# Altium project VCAN.PrjPcb
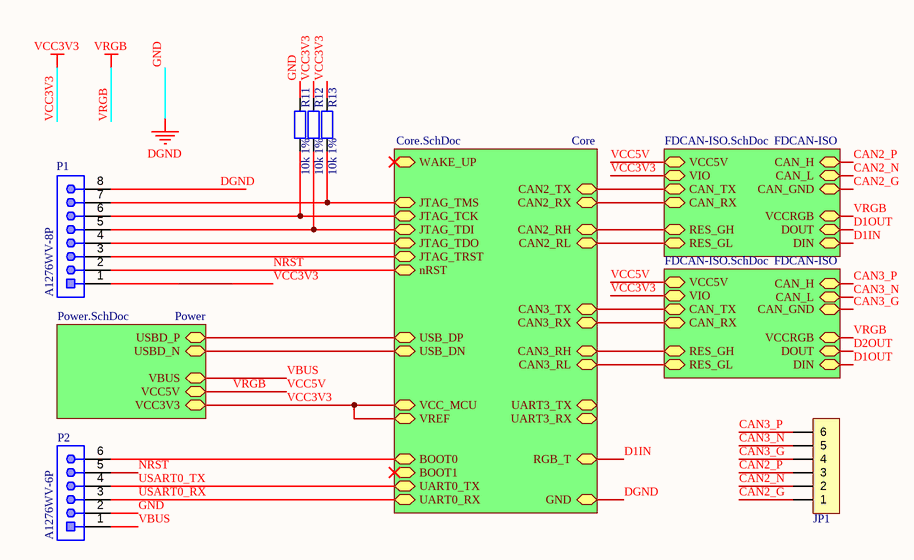
[diagram p0: VCAN.SchDoc]
4 sheets, 103 parts. Net scope: hierarchical (ports join the sheet entries above them; power ports are global).
Board file: VCAN.PcbDoc
Sheets:
  VCAN.SchDoc
    Core = Core.SchDoc
    Power = Power.SchDoc
    FDCAN-ISO = FDCAN-ISO.SchDoc
    FDCAN-ISO = FDCAN-ISO.SchDoc

## Sheet VCAN.SchDoc
size 209 x 148 mm; Author: vseasky; Address1: https://docs.liuwei.vin; Revision: V0.2; SheetNumber: 1; SheetTotal: 4

### Parts
JP1  HDR-1X6  [HT3.96-WI-6P-SMD]  (value not drawn)
P1  A1276WV-8P  [CJT-A1276WV-8P_V]
P2  A1276WV-6P  [CJT-A1276WV-6P_V]
R11  10k 1%  [R 0603_L]
R12  10k 1%  [R 0603_L]
R13  10k 1%  [R 0603_L]

### Sub-sheets
Core = Core.SchDoc: nRST (bidir), WAKE_UP (bidir), JTAG_TDO (bidir), JTAG_TDI (bidir), JTAG_TCK (bidir), JTAG_TMS (bidir), JTAG_TRST (bidir), GND (bidir), USB_DP (bidir), USB_DN (bidir), UART0_TX (bidir), UART0_RX (bidir), VCC_MCU (bidir), VREF (bidir), BOOT0 (bidir), BOOT1 (bidir), UART3_RX (bidir), UART3_TX (bidir), CAN3_RX (bidir), CAN3_TX (bidir), RGB_T (bidir), CAN2_TX (bidir), CAN2_RX (bidir), CAN3_RH (bidir), CAN2_RH (bidir), CAN2_RL (bidir), CAN3_RL (bidir)
FDCAN-ISO = FDCAN-ISO.SchDoc: CAN_H (bidir), CAN_L (bidir), CAN_RX (bidir), CAN_TX (bidir), CAN_GND (bidir), VCC5V (bidir), VIO (bidir), RES_GH (bidir), RES_GL (bidir), VCCRGB (bidir), DOUT (bidir), DIN (bidir)
FDCAN-ISO = FDCAN-ISO.SchDoc: CAN_H (bidir), CAN_L (bidir), CAN_RX (bidir), CAN_TX (bidir), CAN_GND (bidir), VCC5V (bidir), VIO (bidir), RES_GH (bidir), RES_GL (bidir), VCCRGB (bidir), DOUT (bidir), DIN (bidir)
Power = Power.SchDoc: VCC3V3 (bidir), VCC5V (bidir), USBD_P (bidir), USBD_N (bidir), VBUS (bidir)

### Nets
DGND: P1.8 P2.2 R11.1 ; sheet Core/GND  [also labelled GND]
VCC3V3: P1.1 R12.1 R13.1 ; sheet Core/VCC_MCU, sheet Core/VREF, sheet Power/VCC3V3, sheet FDCAN-ISO/VIO, sheet FDCAN-ISO/VIO
VCC5V: sheet Power/VCC5V, sheet FDCAN-ISO/VCC5V, sheet FDCAN-ISO/VCCRGB, sheet FDCAN-ISO/VCC5V, sheet FDCAN-ISO/VCCRGB  [also labelled VRGB]
BOOT0: P2.6 ; sheet Core/BOOT0
CAN2_G: JP1.1 ; sheet FDCAN-ISO/CAN_GND
CAN2_N: JP1.2 ; sheet FDCAN-ISO/CAN_L
CAN2_P: JP1.3 ; sheet FDCAN-ISO/CAN_H
CAN2_RX: sheet Core/CAN2_RX, sheet FDCAN-ISO/CAN_RX
CAN2_TX: sheet Core/CAN2_TX, sheet FDCAN-ISO/CAN_TX
CAN3_G: JP1.4 ; sheet FDCAN-ISO/CAN_GND
CAN3_N: JP1.5 ; sheet FDCAN-ISO/CAN_L
CAN3_P: JP1.6 ; sheet FDCAN-ISO/CAN_H
CAN3_RX: sheet Core/CAN3_RX, sheet FDCAN-ISO/CAN_RX
CAN3_TX: sheet Core/CAN3_TX, sheet FDCAN-ISO/CAN_TX
D1IN: sheet Core/RGB_T, sheet FDCAN-ISO/DIN
D1OUT: sheet FDCAN-ISO/DOUT, sheet FDCAN-ISO/DIN
JTAG_TCK: P1.6 R11.2 ; sheet Core/JTAG_TCK
JTAG_TDI: P1.5 R12.2 ; sheet Core/JTAG_TDI
JTAG_TDO: P1.4 ; sheet Core/JTAG_TDO
JTAG_TMS: P1.7 R13.2 ; sheet Core/JTAG_TMS
JTAG_TRST: P1.3 ; sheet Core/JTAG_TRST
NRST: P1.2 P2.5 ; sheet Core/nRST
RES_GH: sheet Core/CAN2_RH, sheet FDCAN-ISO/RES_GH
RES_GH: sheet Core/CAN3_RH, sheet FDCAN-ISO/RES_GH  [a separate net that carries the same name]
RES_GL: sheet Core/CAN2_RL, sheet FDCAN-ISO/RES_GL
RES_GL: sheet Core/CAN3_RL, sheet FDCAN-ISO/RES_GL  [a separate net that carries the same name]
USART0_RX: P2.3 ; sheet Core/UART0_RX  [project net UART0_RX]
USART0_TX: P2.4 ; sheet Core/UART0_TX  [project net UART0_TX]
USB_D_N: sheet Core/USB_DN, sheet Power/USBD_N
USB_D_P: sheet Core/USB_DP, sheet Power/USBD_P
VBUS: P2.1 ; sheet Power/VBUS  [project net USB_VBUS]

### Library data of the parts
JP1 = Header 6: 6P接插件
P1 = A1276WV-8P: Pin Header, 1.27mm Pitch 180° Single Row, 1 x 8 Position, Height 3.7 mm, -40 to 105 degC, RoHS; Manufacturer: Changjiang Connectors; Contact Resistance: 20mΩ; Current (Max): 1A; Insulation Resistance: 1000MΩ; No. of Rows: 1; No. of Positions: 8; Operating Voltage (V AC/DC): 30V; PIN Material: Brass; PIN Plating: Gold over Nickel; Product Series: A1276 Series; ComponentLink1Description: Manufacturer; ComponentLink1URL: http://www.cjt.com/; ComponentLink2Description: Datasheet; ComponentLink2URL: http://www.cjt.com/UP/A1276WV-XP_dwg.pdf; Part Number: A1276WV-8P; Pitch: 1.27mm; Datasheet Version: REV. A0, 06/2014; Assembly Type: Wafer; Category: Wire to Board; Color: Black; Housing Material: PBT,UL94V-0; Operating Temperature Range: -40℃~105℃; Publisher: Bolgen Studio
P2 = A1276WV-6P: Pin Header, 1.27mm Pitch 180° Single Row, 1 x 6 Position, Height 3.7 mm, -40 to 105 degC, RoHS; Manufacturer: Changjiang Connectors; Contact Resistance: 20mΩ; Current (Max): 1A; Insulation Resistance: 1000MΩ; No. of Rows: 1; No. of Positions: 6; Operating Voltage (V AC/DC): 30V; PIN Material: Brass; PIN Plating: Gold over Nickel; Product Series: A1276 Series; ComponentLink1Description: Manufacturer; ComponentLink1URL: http://www.cjt.com/; ComponentLink2Description: Datasheet; ComponentLink2URL: http://www.cjt.com/UP/A1276WV-XP_dwg.pdf; Part Number: A1276WV-6P; Pitch: 1.27mm; Datasheet Version: REV. A0, 06/2014; Assembly Type: Wafer; Category: Wire to Board; Color: Black; Housing Material: PBT,UL94V-0; Operating Temperature Range: -40℃~105℃; Publisher: Bolgen Studio
R11-R13 = R: 贴片电阻

## Sheet Core.SchDoc
size A4; Author: vseasky; Address1: https://docs.liuwei.vin; Revision: V0.2; SheetNumber: 3; SheetTotal: 4
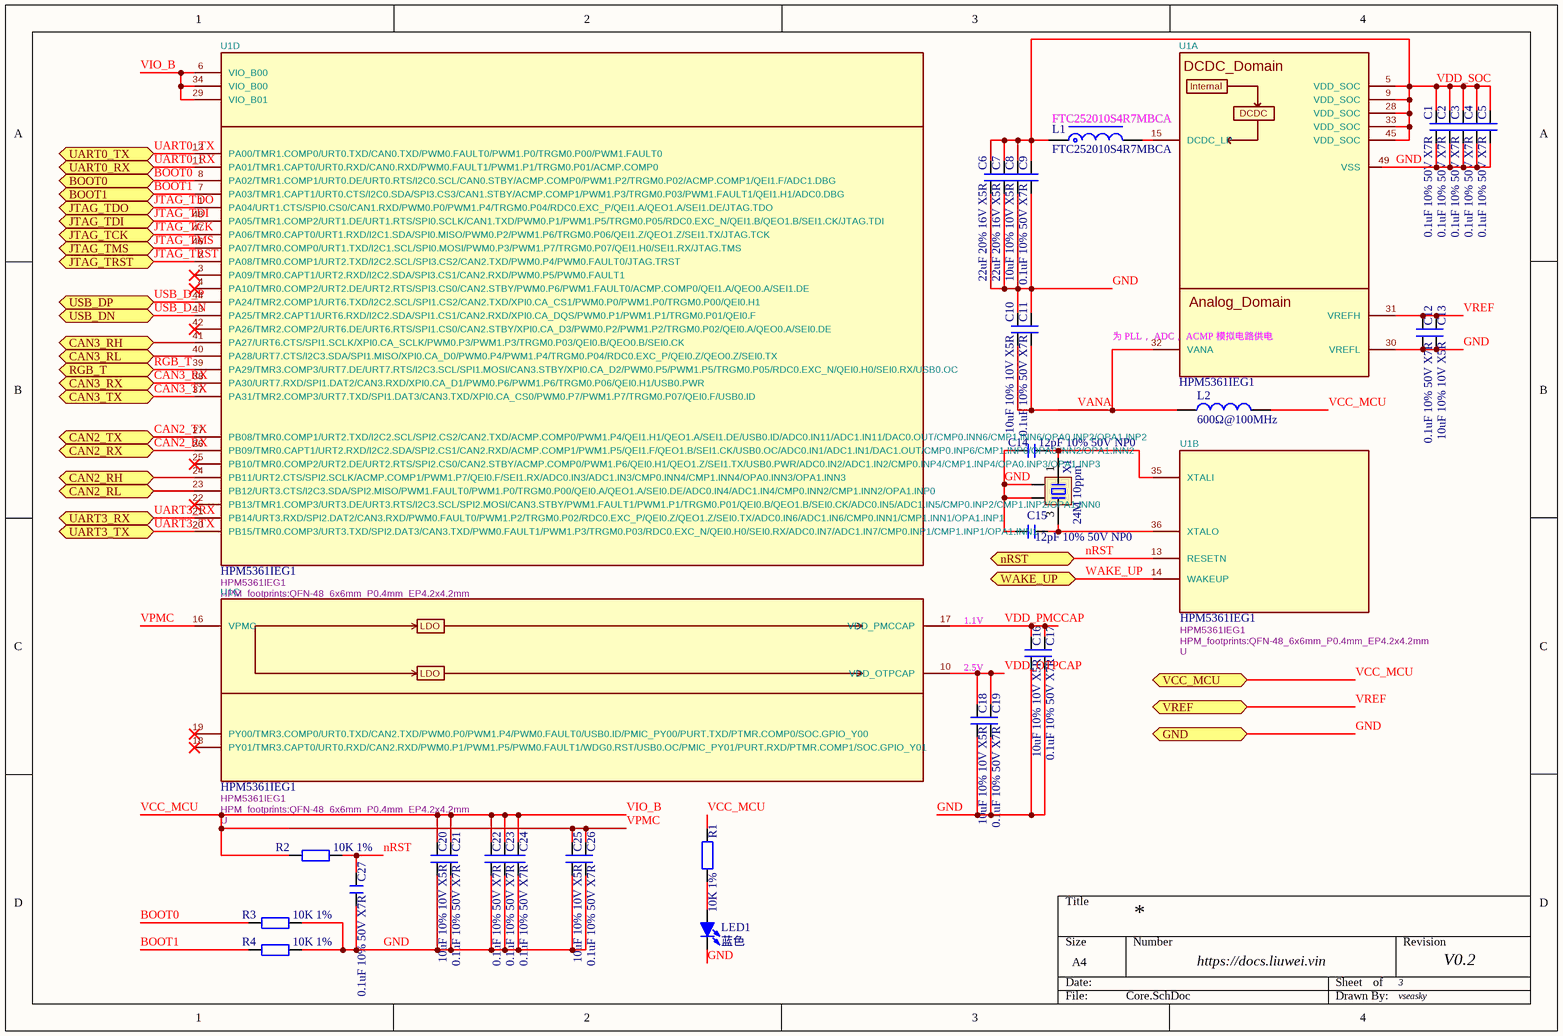
[diagram p1: Core.SchDoc]

### Parts
C1  0.1uF 10% 50V X7R  [C 0603_L]
C2  0.1uF 10% 50V X7R  [C 0603_L]
C3  0.1uF 10% 50V X7R  [C 0603_L]
C4  0.1uF 10% 50V X7R  [C 0603_L]
C5  0.1uF 10% 50V X7R  [C 0603_L]
C6  22uF 20% 16V X5R  [C 0603_L]
C7  22uF 20% 16V X5R  [C 0603_L]
C8  10uF 10% 10V X5R  [C 0603_L]
C9  0.1uF 10% 50V X7R  [C 0603_L]
C10  10uF 10% 10V X5R  [C 0603_L]
C11  0.1uF 10% 50V X7R  [C 0603_L]
C12  0.1uF 10% 50V X7R  [C 0603_L]
C13  10uF 10% 10V X5R  [C 0603_L]
C14  12pF 10% 50V NP0  [C 0603_L]
C15  12pF 10% 50V NP0  [C 0603_L]
C16  10uF 10% 10V X5R  [C 0603_L]
C17  0.1uF 10% 50V X7R  [C 0603_L]
C18  10uF 10% 10V X5R  [C 0603_L]
C19  0.1uF 10% 50V X7R  [C 0603_L]
C20  10uF 10% 10V X5R  [C 0603_L]
C21  0.1uF 10% 50V X7R  [C 0603_L]
C22  0.1uF 10% 50V X7R  [C 0603_L]
C23  0.1uF 10% 50V X7R  [C 0603_L]
C24  0.1uF 10% 50V X7R  [C 0603_L]
C25  10uF 10% 10V X5R  [C 0603_L]
C26  0.1uF 10% 50V X7R  [C 0603_L]
C27  0.1uF 10% 50V X7R  [C 0603_L]
L1  FTC252010S4R7MBCA  [NR2520]
L2  600Ω@100MHz  [L 0603_L]
LED1  蓝色  [LED 0603R]
R1  10K 1%  [R 0603_L]
R2  10K 1%  [R 0603_L]
R3  10K 1%  [R 0603_L]
R4  10K 1%  [R 0603_L]
U1  HPM5361IEG1  [QFN-48_6x6mm_P0.4mm_EP4.2x4.2mm]  (parts A,B,C,D of 4)
X1  24M 10ppm  [OSC 3225-4P]

### Ports
BOOT0 (bidir, see VCAN[5C]), BOOT1 (bidir, see VCAN[5C]), CAN2_RH (bidir, see VCAN[4D]), CAN2_RL (bidir, see VCAN[4D]), CAN2_RX (bidir, see VCAN[4E]), CAN2_TX (bidir, see VCAN[4E]), CAN3_RH (bidir, see VCAN[4C]), CAN3_RL (bidir, see VCAN[4C]), CAN3_RX (bidir, see VCAN[4D]), CAN3_TX (bidir, see VCAN[4D]), GND (bidir, see VCAN[4B]), JTAG_TCK (bidir, see VCAN[5E]), JTAG_TDI (bidir, see VCAN[5D]), JTAG_TDO (bidir, see VCAN[5D]), JTAG_TMS (bidir, see VCAN[5E]), JTAG_TRST (bidir, see VCAN[5D]), nRST (bidir, see VCAN[5D]), RGB_T (bidir, see VCAN[4C]), UART0_RX (bidir, see VCAN[5B]), UART0_TX (bidir, see VCAN[5B]), UART3_RX (bidir, see VCAN[4C]), UART3_TX (bidir, see VCAN[4C]), USB_DN (bidir, see VCAN[5C]), USB_DP (bidir, see VCAN[5D]), VCC_MCU (bidir, see VCAN[5C]), VREF (bidir, see VCAN[5C]), WAKE_UP (bidir, see VCAN[5E])

### Nets
GND: C1.1 C2.1 C3.1 C4.1 C5.1 C6.1 C7.1 C8.1 C9.1 C10.2 C11.2 C12.1 C13.1 C14.2 C15.2 C16.1 C17.1 C18.1 C19.1 C20.1 C21.1 C22.1 C23.1 C24.2 C25.1 C26.1 C27.1 LED1.2(K) R3.2 R4.2 U1.30(VREFL) U1.49(VSS) X1.2 X1.4 ; port GND  [project net DGND]
VCC_MCU: C12.2 C13.2 C20.2 C21.2 C22.2 C23.2 C24.1 C25.2 C26.2 L2.2 R1.2 R2.1 U1.6(VIO_B00) U1.16(VPMC) U1.29(VIO_B01) U1.31(VREFH) U1.34(VIO_B00) ; port VCC_MCU, port VREF  [also labelled VIO_B, VPMC, VREF]  [project net VCC3V3]
BOOT0: R3.1 U1.8(PA02/TMR1.COMP1/URT0.DE/URT0.RTS/I2C0.SCL/CAN0.STBY/ACMP.COMP0/PWM1.P2/TRGM0.P02/ACMP.COMP1/QEI1.F/ADC1.DBG) ; port BOOT0
BOOT1: R4.1 U1.7(PA03/TMR1.CAPT1/URT0.CTS/I2C0.SDA/SPI3.CS3/CAN1.STBY/ACMP.COMP1/PWM1.P3/TRGM0.P03/PWM1.FAULT1/QEI1.H1/ADC0.DBG) ; port BOOT1
CAN2_RX: U1.26(PB09/TMR0.CAPT1/URT2.RXD/I2C2.SDA/SPI2.CS1/CAN2.RXD/ACMP.COMP1/PWM1.P5/QEI1.F/QEO1.B/SEI1.CK/USB0.OC/ADC0.IN1/ADC1.IN1/DAC1.OUT/CMP0.INP6/CMP1.INP6/OPA0.INN2/OPA1.INN2) ; port CAN2_RX
CAN2_TX: U1.27(PB08/TMR0.COMP1/URT2.TXD/I2C2.SCL/SPI2.CS2/CAN2.TXD/ACMP.COMP0/PWM1.P4/QEI1.H1/QEO1.A/SEI1.DE/USB0.ID/ADC0.IN11/ADC1.IN11/DAC0.OUT/CMP0.INN6/CMP1.INN6/OPA0.INP2/OPA1.INP2) ; port CAN2_TX
CAN3_RX: U1.38(PA30/URT7.RXD/SPI1.DAT2/CAN3.RXD/XPI0.CA_D1/PWM0.P6/PWM1.P6/TRGM0.P06/QEI0.H1/USB0.PWR) ; port CAN3_RX
CAN3_TX: U1.37(PA31/TMR2.COMP3/URT7.TXD/SPI1.DAT3/CAN3.TXD/XPI0.CA_CS0/PWM0.P7/PWM1.P7/TRGM0.P07/QEI0.F/USB0.ID) ; port CAN3_TX
JTAG_TCK: U1.47(PA06/TMR0.CAPT0/URT1.RXD/I2C1.SDA/SPI0.MISO/PWM0.P2/PWM1.P6/TRGM0.P06/QEI1.Z/QEO1.Z/SEI1.TX/JTAG.TCK) ; port JTAG_TCK
JTAG_TDI: U1.48(PA05/TMR1.COMP2/URT1.DE/URT1.RTS/SPI0.SCLK/CAN1.TXD/PWM0.P1/PWM1.P5/TRGM0.P05/RDC0.EXC_N/QEI1.B/QEO1.B/SEI1.CK/JTAG.TDI) ; port JTAG_TDI
JTAG_TDO: U1.1(PA04/URT1.CTS/SPI0.CS0/CAN1.RXD/PWM0.P0/PWM1.P4/TRGM0.P04/RDC0.EXC_P/QEI1.A/QEO1.A/SEI1.DE/JTAG.TDO) ; port JTAG_TDO
JTAG_TMS: U1.46(PA07/TMR0.COMP0/URT1.TXD/I2C1.SCL/SPI0.MOSI/PWM0.P3/PWM1.P7/TRGM0.P07/QEI1.H0/SEI1.RX/JTAG.TMS) ; port JTAG_TMS
JTAG_TRST: U1.2(PA08/TMR0.COMP1/URT2.TXD/I2C2.SCL/SPI3.CS2/CAN2.TXD/PWM0.P4/PWM0.FAULT0/JTAG.TRST) ; port JTAG_TRST
NRST: C27.2 R2.2 U1.13(RESETN) ; port nRST
RES_GH: U1.24(PB11/URT2.CTS/SPI2.SCLK/ACMP.COMP1/PWM1.P7/QEI0.F/SEI1.RX/ADC0.IN3/ADC1.IN3/CMP0.INN4/CMP1.INN4/OPA0.INN3/OPA1.INN3) ; port CAN2_RH
RES_GH: U1.41(PA27/URT6.CTS/SPI1.SCLK/XPI0.CA_SCLK/PWM0.P3/PWM1.P3/TRGM0.P03/QEI0.B/QEO0.B/SEI0.CK) ; port CAN3_RH  [a separate net that carries the same name]
RES_GL: U1.23(PB12/URT3.CTS/I2C3.SDA/SPI2.MISO/PWM1.FAULT0/PWM1.P0/TRGM0.P00/QEI0.A/QEO1.A/SEI0.DE/ADC0.IN4/ADC1.IN4/CMP0.INN2/CMP1.INN2/OPA1.INP0) ; port CAN2_RL
RES_GL: U1.40(PA28/URT7.CTS/I2C3.SDA/SPI1.MISO/XPI0.CA_D0/PWM0.P4/PWM1.P4/TRGM0.P04/RDC0.EXC_P/QEI0.Z/QEO0.Z/SEI0.TX) ; port CAN3_RL  [a separate net that carries the same name]
RGB_T: U1.39(PA29/TMR3.COMP3/URT7.DE/URT7.RTS/I2C3.SCL/SPI1.MOSI/CAN3.STBY/XPI0.CA_D2/PWM0.P5/PWM1.P5/TRGM0.P05/RDC0.EXC_N/QEI0.H0/SEI0.RX/USB0.OC) ; port RGB_T  [project net D1IN]
UART0_RX: U1.11(PA01/TMR1.CAPT0/URT0.RXD/CAN0.RXD/PWM0.FAULT1/PWM1.P1/TRGM0.P01/ACMP.COMP0) ; port UART0_RX
UART0_TX: U1.12(PA00/TMR1.COMP0/URT0.TXD/CAN0.TXD/PWM0.FAULT0/PWM1.P0/TRGM0.P00/PWM1.FAULT0) ; port UART0_TX
UART3_RX: U1.21(PB14/URT3.RXD/SPI2.DAT2/CAN3.RXD/PWM0.FAULT0/PWM1.P2/TRGM0.P02/RDC0.EXC_P/QEI0.Z/QEO1.Z/SEI0.TX/ADC0.IN6/ADC1.IN6/CMP0.INN1/CMP1.INN1/OPA1.INP1) ; port UART3_RX
UART3_TX: U1.20(PB15/TMR0.COMP3/URT3.TXD/SPI2.DAT3/CAN3.TXD/PWM0.FAULT1/PWM1.P3/TRGM0.P03/RDC0.EXC_N/QEI0.H0/SEI0.RX/ADC0.IN7/ADC1.IN7/CMP0.INP1/CMP1.INP1/OPA1.INN1) ; port UART3_TX
USB_D_N: U1.43(PA25/TMR2.CAPT1/URT6.RXD/I2C2.SDA/SPI1.CS1/CAN2.RXD/XPI0.CA_DQS/PWM0.P1/PWM1.P1/TRGM0.P01/QEI0.F) ; port USB_DN
USB_D_P: U1.44(PA24/TMR2.COMP1/URT6.TXD/I2C2.SCL/SPI1.CS2/CAN2.TXD/XPI0.CA_CS1/PWM0.P0/PWM1.P0/TRGM0.P00/QEI0.H1) ; port USB_DP
VANA: C10.1 C11.1 L2.1 U1.32(VANA)
VDD_OTPCAP: C18.2 C19.2 U1.10(VDD_OTPCAP)
VDD_PMCCAP: C16.2 C17.2 U1.17(VDD_PMCCAP)
VDD_SOC: C1.2 C2.2 C3.2 C4.2 C5.2 C6.2 C7.2 C8.2 C9.2 L1.1 U1.5(VDD_SOC) U1.9(VDD_SOC) U1.28(VDD_SOC) U1.33(VDD_SOC) U1.45(VDD_SOC)
WAKE_UP: U1.14(WAKEUP) ; port WAKE_UP
NetC14_1: C14.1 U1.35(XTALI) X1.1
NetC15_1: C15.1 U1.36(XTALO) X1.3
NetL1_2: L1.2 U1.15(DCDC_LP)
NetLED1_1: LED1.1(A) R1.1

Not connected (* = marked no-connect by the designer): U1 3(PA09/TMR0.CAPT1/URT2.RXD/I2C2.SDA/SPI3.CS1/CAN2.RXD/PWM0.P5/PWM0.FAULT1)* 4(PA10/TMR0.COMP2/URT2.DE/URT2.RTS/SPI3.CS0/CAN2.STBY/PWM0.P6/PWM1.FAULT0/ACMP.COMP0/QEI1.A/QEO0.A/SEI1.DE)* 18(PY01/TMR3.CAPT0/URT0.RXD/CAN2.RXD/PWM0.P1/PWM1.P5/PWM0.FAULT1/WDG0.RST/USB0.OC/PMIC_PY01/PURT.RXD/PTMR.COMP1/SOC.GPIO_Y01)* 19(PY00/TMR3.COMP0/URT0.TXD/CAN2.TXD/PWM0.P0/PWM1.P4/PWM0.FAULT0/USB0.ID/PMIC_PY00/PURT.TXD/PTMR.COMP0/SOC.GPIO_Y00)* 22(PB13/TMR1.COMP3/URT3.DE/URT3.RTS/I2C3.SCL/SPI2.MOSI/CAN3.STBY/PWM1.FAULT1/PWM1.P1/TRGM0.P01/QEI0.B/QEO1.B/SEI0.CK/ADC0.IN5/ADC1.IN5/CMP0.INP2/CMP1.INP2/OPA1.INN0)* 25(PB10/TMR0.COMP2/URT2.DE/URT2.RTS/SPI2.CS0/CAN2.STBY/ACMP.COMP0/PWM1.P6/QEI0.H1/QEO1.Z/SEI1.TX/USB0.PWR/ADC0.IN2/ADC1.IN2/CMP0.INP4/CMP1.INP4/OPA0.INP3/OPA1.INP3)* 42(PA26/TMR2.COMP2/URT6.DE/URT6.RTS/SPI1.CS0/CAN2.STBY/XPI0.CA_D3/PWM0.P2/PWM1.P2/TRGM0.P02/QEI0.A/QEO0.A/SEI0.DE)*

### Notes on the sheet
- (near L1) FTC252010S4R7MBCA
- (near U1) 为 PLL， ADC， ACMP 模拟电路供电
- 1.1V
- 2.5V
- (in symbol HPM5361IEG1, part A) DCDC_Domain; Internal; DCDC; Analog_Domain
- (in symbol HPM5361IEG1, part C) LDO

### Library data of the parts
C1-C27 = C: 贴片电容
L1 = L-NR: NR磁胶电感
L2 = L: 小功率贴片电感
LED1 = LED-SMD: 贴片LED
R1-R4 = R: 贴片电阻
U1 = HPM5361IEG1: Reference: U; Value: HPM5361IEG1; Footprint: HPM_footprints:QFN-48_6x6mm_P0.4mm_EP4.2x4.2mm
X1 = XTAL-4P: 4脚无源晶振

## Sheet Power.SchDoc
size 209 x 148 mm; Author: vseasky; Address1: https://docs.liuwei.vin; Revision: V0.2; SheetNumber: 2; SheetTotal: 4
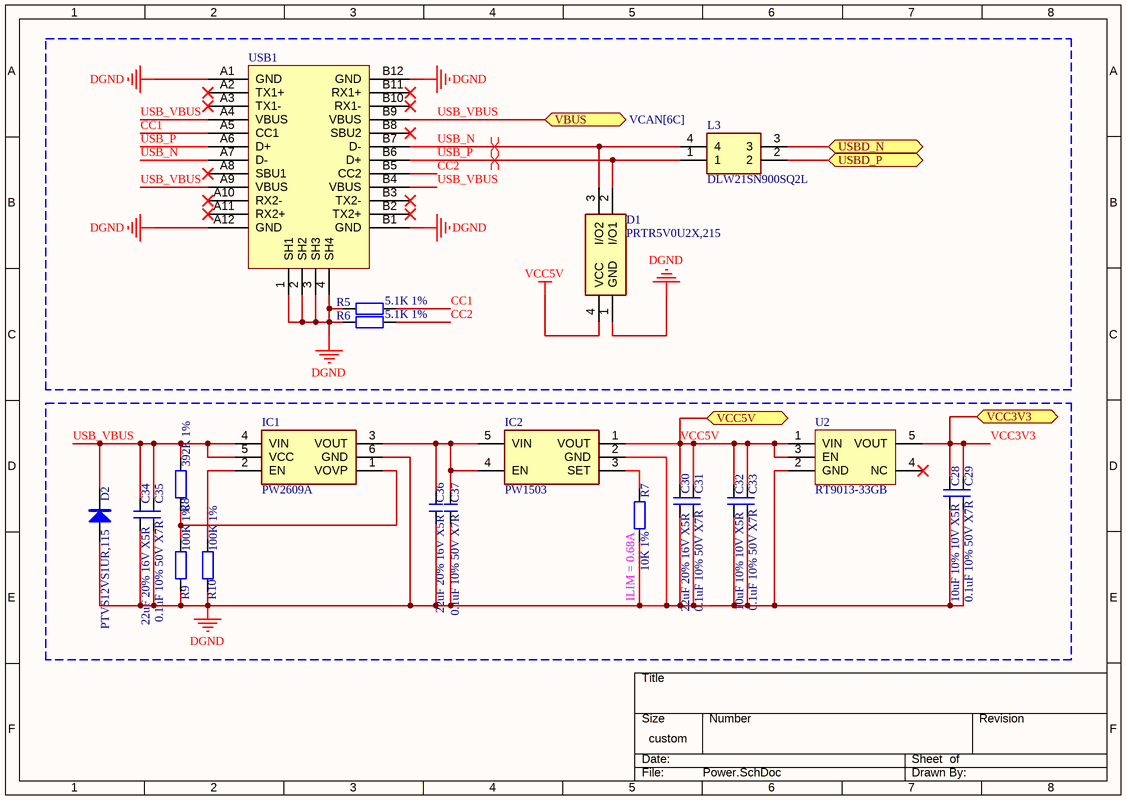
[diagram p2: Power.SchDoc]

### Parts
C28  10uF 10% 10V X5R  [C 0603_L]
C29  0.1uF 10% 50V X7R  [C 0603_L]
C30  22uF 20% 16V X5R  [C 0603_L]
C31  0.1uF 10% 50V X7R  [C 0603_L]
C32  10uF 10% 10V X5R  [C 0603_L]
C33  0.1uF 10% 50V X7R  [C 0603_L]
C34  22uF 20% 16V X5R  [C 0603_L]
C35  0.1uF 10% 50V X7R  [C 0603_L]
C36  22uF 20% 16V X5R  [C 0603_L]
C37  0.1uF 10% 50V X7R  [C 0603_L]
D1  PRTR5V0U2X,215  [SOT-143]
D2  PTVS12VS1UR,115  [SOD-123]
IC1  PW2609A  [SOT-23-6]
IC2  PW1503  [SOT23-5]
L3  DLW21SN900SQ2L  [DLW21SN121HQ2L]
R5  5.1K 1%  [R 0603_L]
R6  5.1K 1%  [R 0603_L]
R7  10K 1%  [R 0603_L]
R8  392K 1%  [R 0603_L]
R9  100K 1%  [R 0603_L]
R10  100K 1%  [R 0603_L]
U2  RT9013-33GB  [SOT23-5M]
USB1  (no value)  [Type-C-TOP]

### Ports
USBD_N (bidir, see VCAN[6C]), USBD_P (bidir, see VCAN[6D]), VBUS (bidir, see VCAN[6C]), VCC3V3 (bidir, see VCAN[6C]), VCC5V (bidir, see VCAN[6C], FDCAN-ISO[8F])

### Nets
DGND: C28.2 C29.2 C30.1 C31.2 C32.2 C33.2 C34.1 C35.1 C36.1 C37.1 D1.1(GND) D2.1(A) IC1.6(GND) IC2.2(GND) R5.1 R6.1 R7.1 R9.2 R10.2 U2.2(GND) USB1.1(SH1) USB1.2(SH2) USB1.3(SH3) USB1.4(SH4) USB1.A1(GND) USB1.A12(GND) USB1.B1(GND) USB1.B12(GND)
VCC3V3: C28.1 C29.1 U2.5(VOUT) ; port VCC3V3
VCC5V: C30.2 C31.1 C32.1 C33.1 D1.4(VCC) IC2.1(VOUT) U2.1(VIN) U2.3(EN) ; port VCC5V
CC1: R5.2 USB1.A5(CC1)
CC2: R6.2 USB1.B5(CC2)
USB_D_N: L3.3 ; port USBD_N
USB_D_P: L3.2 ; port USBD_P
USB_N: D1.3(I/O2) L3.4 USB1.A7(D-) USB1.B7(D-)
USB_P: D1.2(I/O1) L3.1 USB1.A6(D+) USB1.B6(D+)
USB_VBUS: C34.2 C35.2 D2.2(K) IC1.4(VIN) IC1.5(VCC) R8.1 USB1.A4(VBUS) USB1.A9(VBUS) USB1.B4(VBUS) USB1.B9(VBUS) ; port VBUS
NetC36_2: C36.2 C37.2 IC1.3(VOUT) IC2.4(EN) IC2.5(VIN)
NetIC1_1: IC1.1(VOVP) R8.2 R9.1
NetIC1_2: IC1.2(EN) R10.1
NetIC2_3: IC2.3(SET) R7.2

Not connected (* = marked no-connect by the designer): U2 4(NC)*; USB1 A2(TX1+)* A3(TX1-)* A8(SBU1)* A10(RX2-)* A11(RX2+)* B2(TX2+)* B3(TX2-)* B8(SBU2)* B10(RX1-)* B11(RX1+)*

### Layout directives
differential pair: USB_N, USB_P

### Notes on the sheet
- (near R7) ILIM = 0.68A

### Library data of the parts
C28-C37 = C: 贴片电容
D1 = PRTR5V0U2X,215: Diode; Manufacturer_Name: Nexperia; Datasheet Link: https://assets.nexperia.com/documents/data-sheet/PRTR5V0U2X.pdf; Height: 1.1mm; Manufacturer_Part_Number: PRTR5V0U2X,215; Mouser Part Number: 771-PRTR5V0U2X-T/R; Mouser Price/Stock: https://www.mouser.co.uk/ProductDetail/Nexperia/PRTR5V0U2X215?qs=LOCUfHb8d9sDkgY4cRj8Lw%3D%3D; Arrow Part Number: PRTR5V0U2X,215; Arrow Price/Stock: https://www.arrow.com/en/products/prtr5v0u2x215/nexperia?utm_currency=USD&region=nac
D2 = 1N4007: 整流二极管
IC1 = PW2609A: Integrated Circuit; Manufacturer_Name: Aerosemi; Manufacturer_Part_Number: MT9700; Datasheet Link: https://datasheet.lcsc.com/szlcsc/1809291208_XI-AN-Aerosemi-Tech-MT9700_C89855.pdf; Height: 1.35mm
IC2 = MT9700: Integrated Circuit; Manufacturer_Name: Aerosemi; Datasheet Link: https://datasheet.lcsc.com/szlcsc/1809291208_XI-AN-Aerosemi-Tech-MT9700_C89855.pdf; Height: 1.35mm; Manufacturer_Part_Number: MT9700
L3 = DLW21SN900SQ2L: Inductor; Manufacturer_Name: Murata Electronics; Datasheet Link: https://datasheet.datasheetarchive.com/originals/distributors/Datasheets_SAMA/ece8820704b5ec0ab68e5b2fda1b5649.pdf; Height: 1.4mm; Manufacturer_Part_Number: DLW21SN900SQ2L; Mouser Part Number: 81-DLW21SN900SQ2L; Mouser Price/Stock: https://www.mouser.co.uk/ProductDetail/Murata-Electronics/DLW21SN900SQ2L?qs=yQ3nQrcaeVsNzdZbwxOhwQ%3D%3D; Arrow Part Number: DLW21SN900SQ2L; Arrow Price/Stock: https://www.arrow.com/en/products/dlw21sn900sq2l/murata-manufacturing?region=europe
R5-R10 = R: 贴片电阻
USB1 = USB_Type-C

## Sheet FDCAN-ISO.SchDoc
size 209 x 148 mm; SheetNumber: 4; SheetTotal: 4
Used 2 times, as channels FDCAN-ISO, FDCAN-ISO. Parts and nets are listed once, with the designators drawn on the sheet.
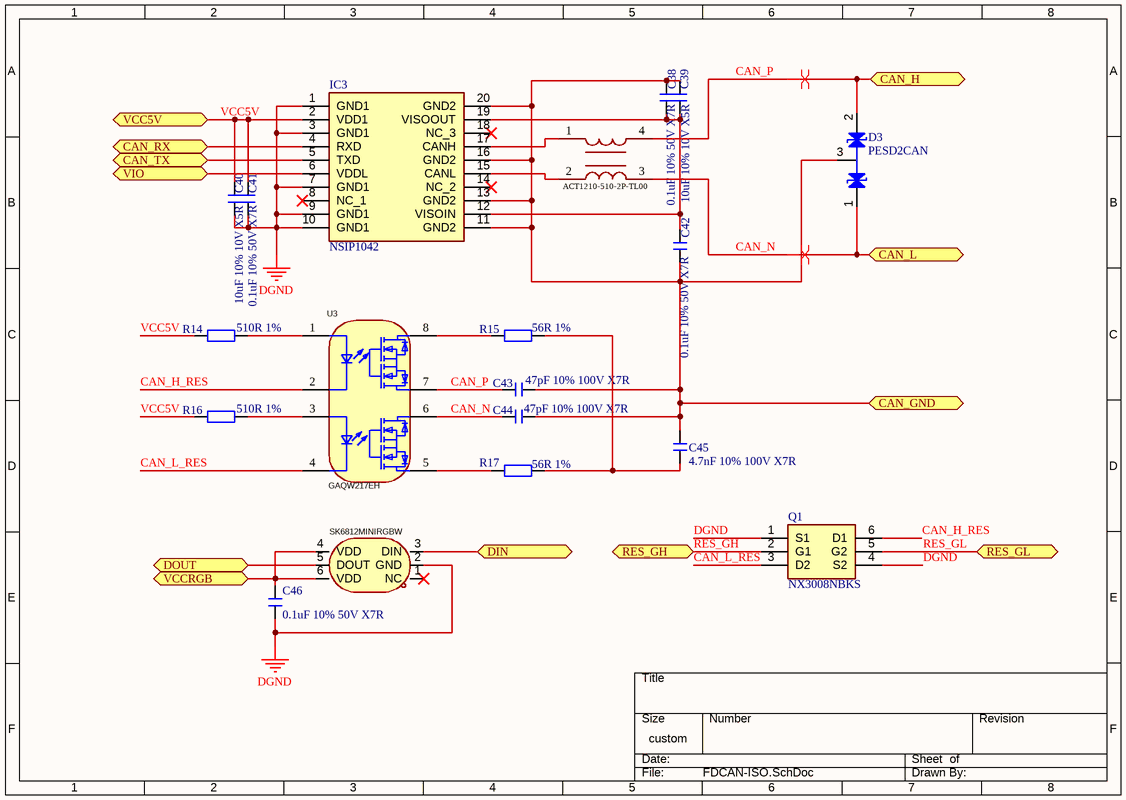
[diagram p3: FDCAN-ISO.SchDoc]

### Parts
C38  0.1uF 10% 50V X7R  [C 0603_L]
C39  10uF 10% 10V X5R  [C 0603_L]
C40  10uF 10% 10V X5R  [C 0603_L]
C41  0.1uF 10% 50V X7R  [C 0603_L]
C42  0.1uF 10% 50V X7R  [C 0603_L]
C43  47pF 10% 100V X7R  [C 0603_L]
C44  47pF 10% 100V X7R  [C 0603_L]
C45  4.7nF 10% 100V X7R  [C 0603_L]
C46  0.1uF 10% 50V X7R  [C 0603_L]
D3  PESD2CAN  [SOT23-3L]
IC3  NSIP1042  [SOP20]
L4  ACT1210-510-2P-TL00  [SMD_4P-L3.2-W2.5]
LED2  SK6812MINIRGBW  [LED-ARRAY-SMD_6P-L3.7-W3.5]
Q1  NX3008NBKS  [SOT-363]
R14  510R 1%  [R 0603_L]
R15  56R 1%  [R 0603_L]
R16  510R 1%  [R 0603_L]
R17  56R 1%  [R 0603_L]
U3  GAQW217EH  [SMD-8_L9.9-W6.4-P2.54-LS10.0-BR]

### Ports
CAN_GND (bidir, see VCAN[2D]), CAN_H (bidir, see VCAN[2D]), CAN_L (bidir, see VCAN[2D]), CAN_RX (bidir, see VCAN[3D]), CAN_TX (bidir, see VCAN[3D]), DIN (bidir, see VCAN[2C]), DOUT (bidir, see VCAN[2C]), RES_GH (bidir, see VCAN[3C]), RES_GL (bidir, see VCAN[3C]), VCC5V (bidir, see VCAN[3D], Power[3C]), VCCRGB (bidir, see VCAN[2D]), VIO (bidir, see VCAN[3D])

### Nets
DGND: C40.2 C41.1 C46.1 IC3.1(GND1) IC3.3(GND1) IC3.7(GND1) IC3.9(GND1) IC3.10(GND1) LED2.2(GND) Q1.1(S1) Q1.4(S2)
CAN_GND: C38.2 C39.1 C42.1 C43.2 C44.1 C45.1 D3.3 IC3.11(GND2) IC3.13(GND2) IC3.16(GND2) IC3.20(GND2) ; port CAN_GND
CAN_H_RES: Q1.6(D1) U3.2
CAN_L_RES: Q1.3(D2) U3.4
CAN_N: C44.2 D3.1 L4.3 U3.6 ; port CAN_L
CAN_P: C43.1 D3.2 L4.4 U3.7 ; port CAN_H
CAN_RX: IC3.4(RXD) ; port CAN_RX
CAN_TX: IC3.5(TXD) ; port CAN_TX
DIN: LED2.3(DIN) ; port DIN
DOUT: LED2.5(DOUT) ; port DOUT
RES_GH: Q1.2(G1) ; port RES_GH
RES_GL: Q1.5(G2) ; port RES_GL
VCC5V: C40.1 C41.2 IC3.2(VDD1) R14.2 R16.2 ; port VCC5V
VCCRGB: C46.2 LED2.4(VDD) LED2.6(VDD) ; port VCCRGB
VIO: IC3.6(VDDL) ; port VIO
NetC38_1: C38.1 C39.2 C42.2 IC3.12(VISOIN) IC3.19(VISOOUT)
NetC45_2: C45.2 R15.1 R17.2
NetIC3_15: IC3.15(CANL) L4.2
NetIC3_17: IC3.17(CANH) L4.1
NetR14_1: R14.1 U3.1
NetR15_2: R15.2 U3.8
NetR16_1: R16.1 U3.3
NetR17_1: R17.1 U3.5

Not connected (* = marked no-connect by the designer): IC3 8(NC_1)* 14(NC_2)* 18(NC_3)*; LED2 1(NC)*

### Channels
FDCAN-ISO: designators end in _FDCAN-ISO#1; ports CAN_GND=CAN2_G CAN_H=CAN2_P CAN_L=CAN2_N CAN_RX=CAN2_RX CAN_TX=CAN2_TX DIN=D1IN DOUT=D1OUT RES_GH=RES_GH RES_GL=RES_GL VCC5V=VCC5V VCCRGB=VCC5V VIO=VCC3V3
FDCAN-ISO: designators end in _FDCAN-ISO#2; ports CAN_GND=CAN3_G CAN_H=CAN3_P CAN_L=CAN3_N CAN_RX=CAN3_RX CAN_TX=CAN3_TX DIN=D1OUT DOUT=D2OUT RES_GH=RES_GH RES_GL=RES_GL VCC5V=VCC5V VCCRGB=VCC5V VIO=VCC3V3

### Layout directives
differential pair: CAN2_N, CAN2_P

### Library data of the parts
C38-C46 = C: 贴片电容
IC3 = NSIP1042: Integrated Circuit; Manufacturer_Name: NOVOSENSE; Datasheet Link: https://www.novosns.com/files/NSiP1042_Datasheet_Rev1.0_EN.pdf; Height: 2.65mm; Manufacturer_Part_Number: NSIP1042
L4 = ACT1210-510-2P-TL00: Manufacturer: TDK; Symbol: ACT45B-510-2P-TL003; Add into BOM: yes; Number of Lines: 2; Withstanding Voltage: 250V@2secs; Current Rating: 200mA; Inductance @ Frequency: 51uH@100kHz; Voltage Rating - DC: 50V; Impedance @ Frequency: 2.8kΩ@10MHz; DC Resistance (DCR): 1Ω; Device: ACT45B-510-2P-TL003; LCSC Part Name: 两路 4532共模滤波器 阻抗2.8kΩ@10MHz; Supplier Part: C76584; Manufacturer Part: ACT45B-510-2P-TL003; Supplier Footprint: SMD,4.5x3.2mm; JLCPCB Part Class: Extended Part; Datasheet: https://atta.szlcsc.com/upload/public/pdf/source/20160918/1474166842057.pdf; Supplier: LCSC; Convert to PCB: yes; Voltage Rating: -; Operating Temperature: -40℃~+150℃
LED2 = SK6812MINIRGBW-BW-P6-A: Manufacturer: 欧思科光电; Add into BOM: yes; Symbol: SK6812MINIRGBW-BW-P6-A; Device: SK6812MINIRGBW-BW-P6-A; LCSC Part Name: SK6812MINIRGBW-BW-P6-A; Supplier Part: C7423105; Manufacturer Part: SK6812MINIRGBW-BW-P6-A; Supplier Footprint: SMD,3.5x3.7mm; JLCPCB Part Class: Extended Part; Datasheet: https://atta.szlcsc.com/upload/public/pdf/source/20230612/4DBDBEE6CD9AD57889E7B23729FE64E4.pdf; Supplier: LCSC; Convert to PCB: yes
Q1 = NX3008NBKS: MOSFET (N-Channel); Manufacturer_Name: Nexperia; Manufacturer_Part_Number: NX3008NBKS,115; Datasheet Link: https://assets.nexperia.com/documents/data-sheet/NX3008NBKS.pdf; Height: 1.1mm; Mouser Part Number: 771-NX3008NBKS,115; Mouser Price/Stock: https://www.mouser.co.uk/ProductDetail/Nexperia/NX3008NBKS115?qs=N31o%252Bt096gvSMWdFEcaa8A%3D%3D; Arrow Part Number: NX3008NBKS,115; Arrow Price/Stock: https://www.arrow.com/en/products/nx3008nbks115/nexperia?utm_currency=USD&region=nac
R14-R17 = R: 贴片电阻
U3 = GAQW217EH: Manufacturer: SUPSiC(国晶微半导体); Add into BOM: yes; Forward Current(If): 7mA; Voltage - Forward(Vf): 1.2V; Load Voltage: 200V; Load Current: 200mA; RDS(on): 5Ω; Isolation Voltage(Vrms): 5kV; Turn-on time: 400us; Turn-off time: 50us; Symbol: GAQW217EH; Device: GAQW217EH; LCSC Part Name: GAQW217EH; Supplier Part: C42463227; Manufacturer Part: GAQW217EH; Supplier Footprint: SMD-8P; JLCPCB Part Class: Extended Part; Datasheet: https://atta.szlcsc.com/upload/public/pdf/source/20250211/599B2BE388980A1F19AA516DEECC9227.pdf; Supplier: LCSC; Convert to PCB: yes; Operating Temperature: -40℃~+85℃

## Nets that join several sheets
DGND: VCAN (P1.8 P2.2 R11.1), Core (34 pins), Power (28 pins), FDCAN-ISO (11 pins), FDCAN-ISO (11 pins)
VCC3V3: VCAN (P1.1 R12.1 R13.1), Core (17 pins), Power (C28.1 C29.1 U2.5), FDCAN-ISO (IC3_FDCAN-ISO#1.6), FDCAN-ISO (IC3_FDCAN-ISO#2.6)
VCC5V: Power (8 pins), FDCAN-ISO (8 pins), FDCAN-ISO (8 pins)
BOOT0: VCAN (P2.6), Core (R3.1 U1.8)
CAN2_G: VCAN (JP1.1), FDCAN-ISO (11 pins)
CAN2_N: VCAN (JP1.2), FDCAN-ISO (C44_FDCAN-ISO#1.2 D3_FDCAN-ISO#1.1 L4_FDCAN-ISO#1.3 U3_FDCAN-ISO#1.6)
CAN2_P: VCAN (JP1.3), FDCAN-ISO (C43_FDCAN-ISO#1.1 D3_FDCAN-ISO#1.2 L4_FDCAN-ISO#1.4 U3_FDCAN-ISO#1.7)
CAN2_RX: Core (U1.26), FDCAN-ISO (IC3_FDCAN-ISO#1.4)
CAN2_TX: Core (U1.27), FDCAN-ISO (IC3_FDCAN-ISO#1.5)
CAN3_G: VCAN (JP1.4), FDCAN-ISO (11 pins)
CAN3_N: VCAN (JP1.5), FDCAN-ISO (C44_FDCAN-ISO#2.2 D3_FDCAN-ISO#2.1 L4_FDCAN-ISO#2.3 U3_FDCAN-ISO#2.6)
CAN3_P: VCAN (JP1.6), FDCAN-ISO (C43_FDCAN-ISO#2.1 D3_FDCAN-ISO#2.2 L4_FDCAN-ISO#2.4 U3_FDCAN-ISO#2.7)
CAN3_RX: Core (U1.38), FDCAN-ISO (IC3_FDCAN-ISO#2.4)
CAN3_TX: Core (U1.37), FDCAN-ISO (IC3_FDCAN-ISO#2.5)
D1IN: Core (U1.39), FDCAN-ISO (LED2_FDCAN-ISO#1.3)
D1OUT: FDCAN-ISO (LED2_FDCAN-ISO#1.5), FDCAN-ISO (LED2_FDCAN-ISO#2.3)
JTAG_TCK: VCAN (P1.6 R11.2), Core (U1.47)
JTAG_TDI: VCAN (P1.5 R12.2), Core (U1.48)
JTAG_TDO: VCAN (P1.4), Core (U1.1)
JTAG_TMS: VCAN (P1.7 R13.2), Core (U1.46)
JTAG_TRST: VCAN (P1.3), Core (U1.2)
NRST: VCAN (P1.2 P2.5), Core (C27.2 R2.2 U1.13)
RES_GH: Core (U1.24), FDCAN-ISO (Q1_FDCAN-ISO#1.2)
RES_GH: Core (U1.41), FDCAN-ISO (Q1_FDCAN-ISO#2.2)
RES_GL: Core (U1.23), FDCAN-ISO (Q1_FDCAN-ISO#1.5)
RES_GL: Core (U1.40), FDCAN-ISO (Q1_FDCAN-ISO#2.5)
UART0_RX: VCAN (P2.3), Core (U1.11)
UART0_TX: VCAN (P2.4), Core (U1.12)
USB_D_N: Core (U1.43), Power (L3.3)
USB_D_P: Core (U1.44), Power (L3.2)
USB_VBUS: VCAN (P2.1), Power (10 pins)

## Assembly variants
basic: all parts fitted
DNP: not fitted R6 R9 R10